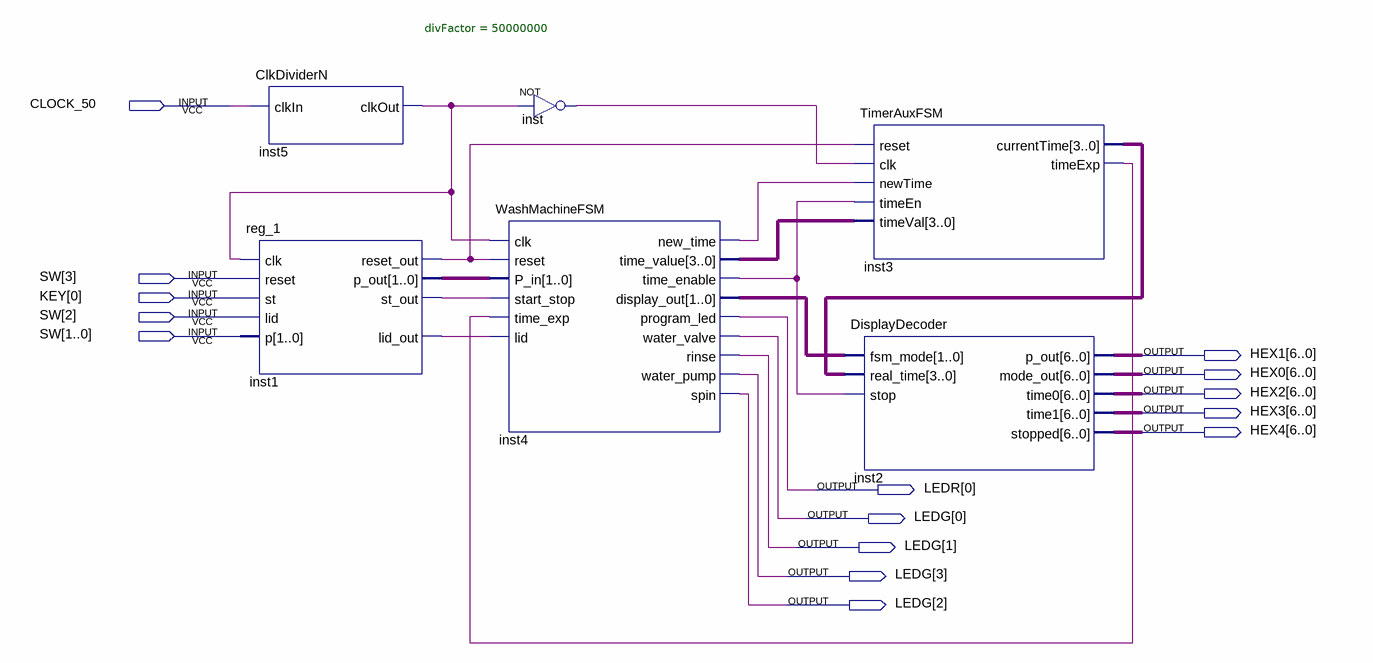
[diagram p0: schematic sheet]
// Quartus schematic WashingMachine_v3.bdf as structural Verilog: 6 symbols, 15 pins
module WashingMachine_v3 (
  input  CLOCK_50,
  input  [3:0] SW,
  input  [0:0] KEY,
  output [6:0] HEX1,
  output [6:0] HEX0,
  output [6:0] HEX2,
  output [6:0] HEX3,
  output [6:0] HEX4,
  output [0:0] LEDR,
  output [3:0] LEDG
);

  wire inst1_lid_out, inst1_reset_out, inst1_st_out, inst3_timeexp, inst4_new_time, inst4_time_enable,
       inst5_clkout, inst_out;
  wire [1:0] inst1_p_out, inst4_display_out;
  wire [3:0] inst3_currenttime, inst4_time_value;

  ClkDividerN #(.divFactor(50000000)) inst5 (.clkIn(CLOCK_50), .clkOut(inst5_clkout));
  reg_1 inst1 (
    .clk(inst5_clkout), .reset(SW[3]), .st(KEY[0]), .lid(SW[2]), .p(SW[1:0]), .reset_out(inst1_reset_out),
    .st_out(inst1_st_out), .lid_out(inst1_lid_out), .p_out(inst1_p_out));
  WashMachineFSM inst4 (
    .clk(inst5_clkout), .reset(inst1_reset_out), .P_in(inst1_p_out), .start_stop(inst1_st_out),
    .time_exp(inst3_timeexp), .lid(inst1_lid_out), .new_time(inst4_new_time), .time_value(inst4_time_value),
    .time_enable(inst4_time_enable), .display_out(inst4_display_out), .program_led(LEDR[0]),
    .water_valve(LEDG[0]), .rinse(LEDG[1]), .water_pump(LEDG[3]), .spin(LEDG[2]));
  not inst (inst_out, inst5_clkout);
  TimerAuxFSM inst3 (
    .reset(inst1_reset_out), .clk(inst_out), .newTime(inst4_new_time), .timeEn(inst4_time_enable),
    .timeVal(inst4_time_value), .currentTime(inst3_currenttime), .timeExp(inst3_timeexp));
  DisplayDecoder inst2 (
    .fsm_mode(inst4_display_out), .real_time(inst3_currenttime), .stop(inst4_time_enable), .p_out(HEX1),
    .mode_out(HEX0), .time0(HEX2), .time1(HEX3), .stopped(HEX4));
endmodule
